# EAGLE schematic Glowdeck_beta_proto (EAGLE 6.3)

## Sheet 1 of 11: Main
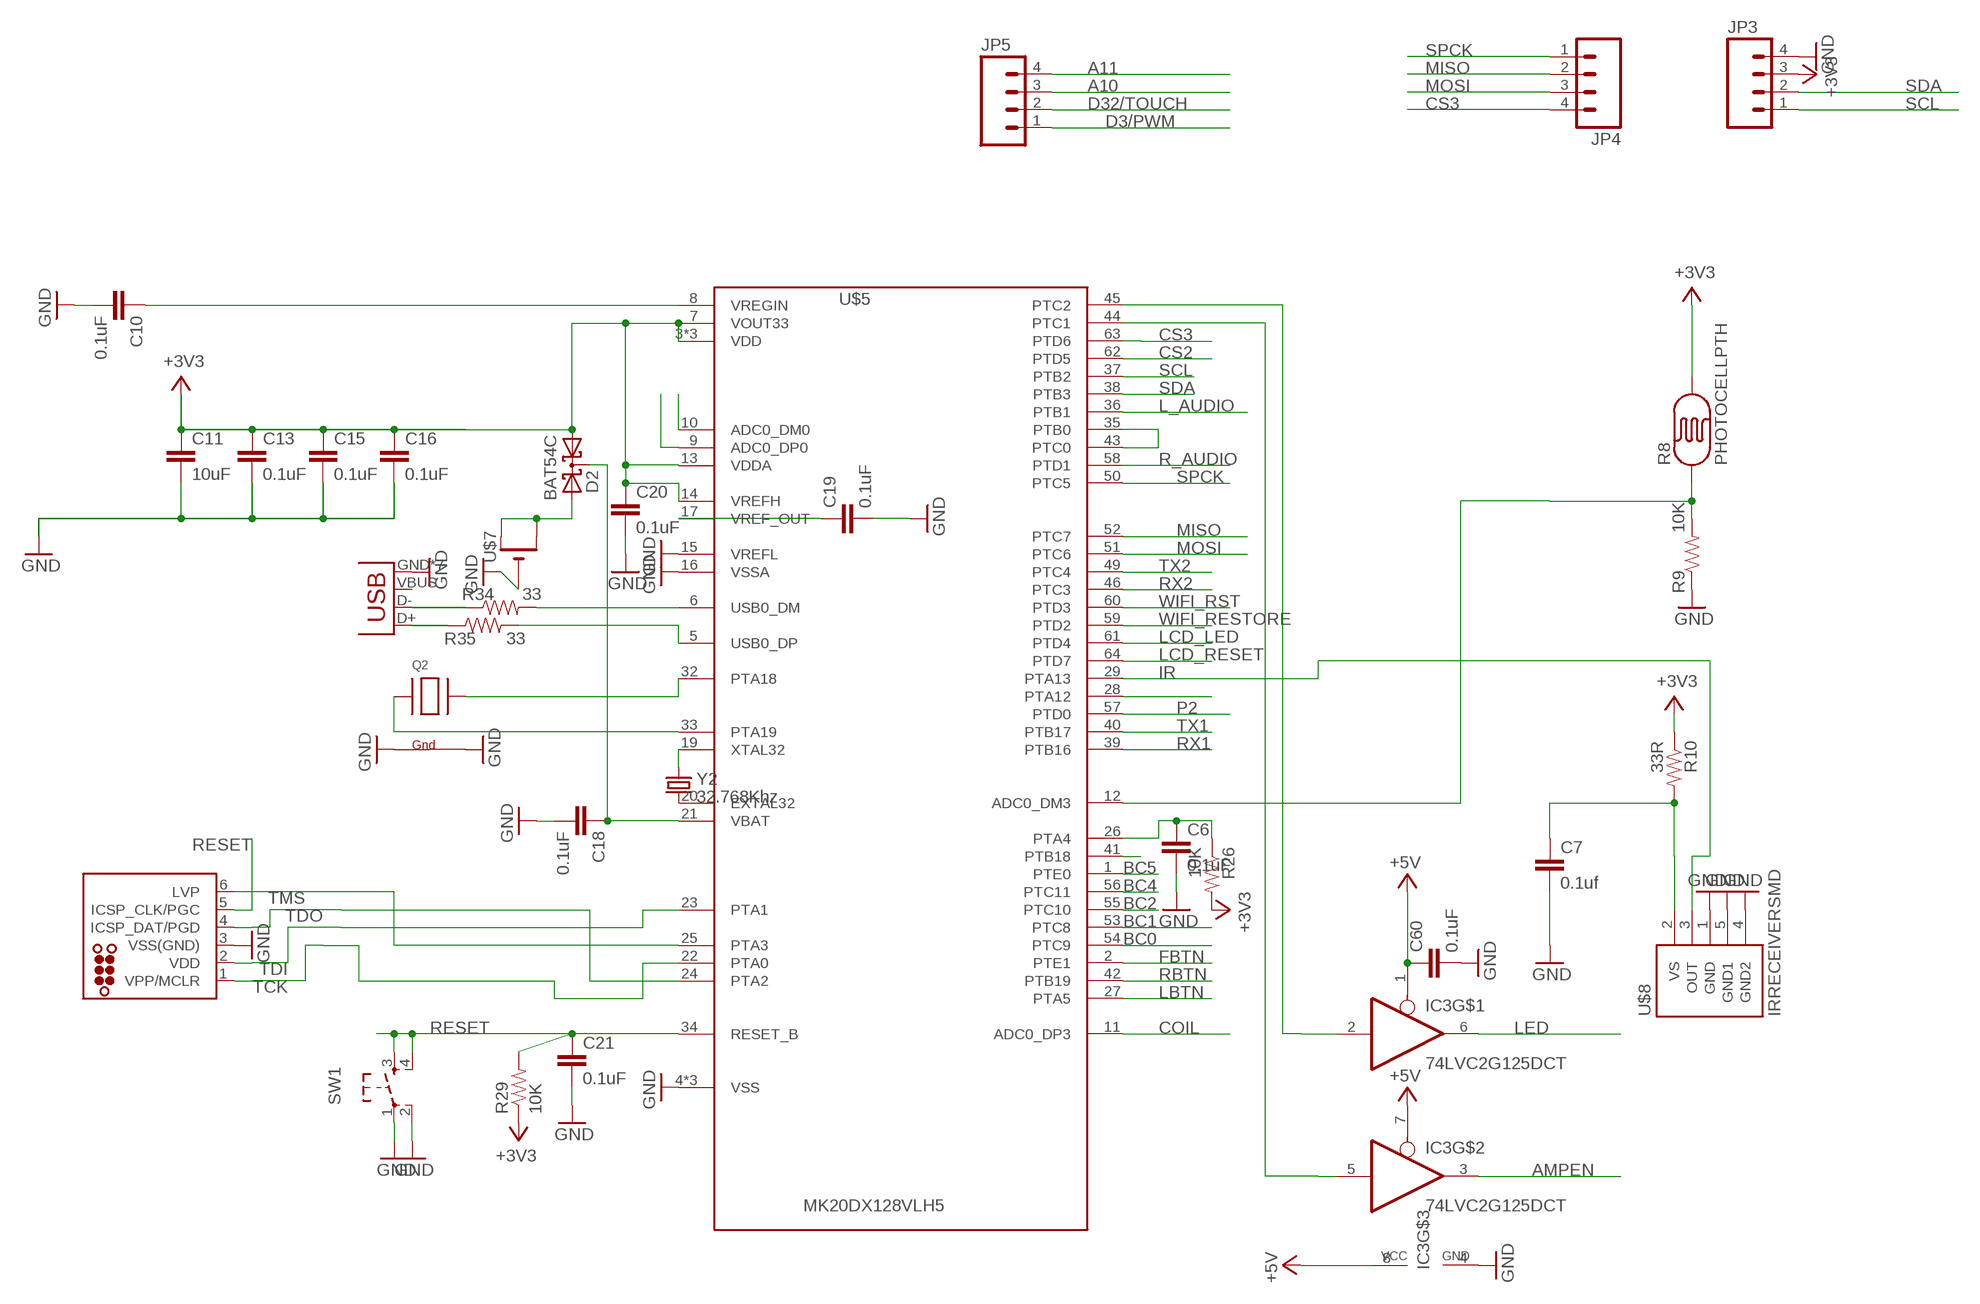
[diagram p0: schematic, sheet 1]

### Parts
C6  0.1uF  CAP0603-CAP  [0603-CAP]
C7  0.1uf  CAP0603-CAP  [0603-CAP]
C10  0.1uF  CAP0603-CAP  [0603-CAP]
C11  10uF  CAP0805  [0805]
C13  0.1uF  CAP0603-CAP  [0603-CAP]
C15  0.1uF  CAP0603-CAP  [0603-CAP]
C16  0.1uF  CAP0603-CAP  [0603-CAP]
C18  0.1uF  CAP0603-CAP  [0603-CAP]
C19  0.1uF  CAP0603-CAP  [0603-CAP]
C20  0.1uF  CAP0603-CAP  [0603-CAP]
C21  0.1uF  CAP0603-CAP  [0603-CAP]
C60  0.1uF  CAP0603-CAP  [0603-CAP]
D2  BAT54C  [SOT23]
IC3  74LVC2G125DCT  [SSOP08]
J2  TC2030-MCP-NL  [TC2030-MCP-NL]
JP3  M04LOCK  [1X04_LOCK]
JP4  M04LOCK  [1X04_LOCK]
JP5  M04LOCK  [1X04_LOCK]
Q2  XTAL-4-3225  [NX3225]
R8  PHOTOCELLPTH  [PHOTOCELL]
R9  10K  RESISTOR0603-RES  [0603-RES]
R10  33R  RESISTOR0603-RES  [0603-RES]
R26  10K  RESISTOR0603-RES  [0603-RES]
R29  10K  RESISTOR0603-RES  [0603-RES]
R34  33  RESISTOR0603-RES  [0603-RES]
R35  33  RESISTOR0603-RES  [0603-RES]
SW1  SW_TACT_4P  [SW_TACT_SMALL]
U$5  MK20DX128VLH5  [MK20DX128VLH5]
U$7  CR1220THM  [CR1220-THM]
U$8  IRRECEIVERSMD  [TSOP8523]
X3  USB-MICROB  [USB-MICROB]
Y2  32.768Khz  RESONATOR_EPSON_FC_145  [RESONATOR_EPSON_FC_145]

### Nets
+3V3 [+3V3]: C11.1 C13.1 C15.1 C16.1 C20.1 D2.1(A1) JP3.3 R8.2 R10.1 R26.2 R29.1 U$5.3(VDD) U$5.7(VOUT33) U$5.13(VDDA) U$5.14(VREFH) U$5.30(VDD) U$5.48(VDD) ; also sheet 2,3,4,5,9
+5V [5v]: C60.1 IC3.1(OE) IC3.7(OE) IC3.8(VCC) ; also sheet 3,4
A10: JP5.3 U$5.9(ADC0_DP0)
A11: JP5.4 U$5.10(ADC0_DM0)
AMPEN: IC3.3(O) ; also sheet 6
BC0: U$5.54(PTC9) ; also sheet 5
BC1: U$5.53(PTC8) ; also sheet 5
BC2: U$5.55(PTC10) ; also sheet 5
BC4: U$5.56(PTC11) ; also sheet 5
BC5: U$5.1(PTE0) ; also sheet 5
COIL: U$5.11(ADC0_DP3) ; also sheet 4
CS2: U$5.62(PTD5) ; also sheet 3
CS3: JP4.4 U$5.63(PTD6)
D3/PWM: JP5.1 U$5.28(PTA12)
D32/TOUCH: JP5.2 U$5.41(PTB18)
FBTN: U$5.2(PTE1) ; also sheet 10
GND [gnd]: C6.2 C7.2 C10.2 C11.2 C13.2 C15.2 C16.2 C18.2 C19.2 C20.2 C21.2 C60.2 IC3.4(GND) J2.3(VSS(GND)) JP3.4 Q2.2(G2) Q2.4(G1) R9.1 SW1.1 SW1.2 U$5.4(VSS) U$5.15(VREFL) U$5.16(VSSA) U$5.31(VSS) U$5.47(VSS) U$7.- U$8.1(GND) U$8.4(GND2) U$8.5(GND1) X3.GND X3.P1(GND) X3.P2(GND) X3.P3(GND) X3.P4(GND) X3.P5(GND) X3.P6(GND) ; also sheet 2,3,4,5,6,7,8,9,10
IR: U$5.29(PTA13) U$8.3(OUT)
L_AUDIO: U$5.36(PTB1) ; also sheet 9
LBTN: U$5.27(PTA5) ; also sheet 10
LCD_LED: U$5.61(PTD4) ; also sheet 3
LCD_RESET: U$5.64(PTD7) ; also sheet 3
LED: IC3.6(O) ; also sheet 8
MISO: JP4.2 U$5.52(PTC7) ; also sheet 3
MOSI: JP4.3 U$5.51(PTC6) ; also sheet 3
N$3: U$5.35(PTB0) U$5.43(PTC0)
N$4: C7.1 R10.2 U$8.2(VS)
N$31: Q2.3(X2) U$5.32(PTA18)
N$33: D2.2(A2) U$7.+1(+) U$7.+2(+1)
N$34: C6.1 R26.1 U$5.26(PTA4)
N$46: U$5.20(EXTAL32) Y2.P$2
N$48: C19.1 U$5.17(VREF_OUT)
N$49: C10.1 U$5.8(VREGIN)
N$50: C18.1 D2.3(CC) U$5.21(VBAT)
N$59: R34.2 U$5.6(USB0_DM)
N$60: R35.2 U$5.5(USB0_DP)
N$61: U$5.19(XTAL32) Y2.P$1
N$66: Q2.1(X1) U$5.33(PTA19)
N$67: R8.1 R9.2 U$5.12(ADC0_DM3)
N$76: IC3.5(I) U$5.44(PTC1)
N$79: IC3.2(I) U$5.45(PTC2)
N$95: R34.1 X3.D-
N$96: R35.1 X3.D+
P2: U$5.57(PTD0) ; also sheet 3
R_AUDIO: U$5.58(PTD1) ; also sheet 9
RBTN: U$5.42(PTB19) ; also sheet 10
RESET: C21.1 J2.5(ICSP_CLK/PGC) R29.2 SW1.3 SW1.4 U$5.34(RESET_B)
RX1: U$5.39(PTB16) ; also sheet 2
RX2: U$5.46(PTC3) ; also sheet 5
SCL: JP3.1 U$5.37(PTB2)
SDA: JP3.2 U$5.38(PTB3)
SPCK: JP4.1 U$5.50(PTC5) ; also sheet 3
TCK: J2.1(VPP/MCLR) U$5.22(PTA0)
TDI: J2.2(VDD) U$5.23(PTA1)
TDO: J2.4(ICSP_DAT/PGD) U$5.24(PTA2)
TMS: J2.6(LVP) U$5.25(PTA3)
TX1: U$5.40(PTB17) ; also sheet 2
TX2: U$5.49(PTC4) ; also sheet 5
WIFI_RESTORE: U$5.59(PTD2) ; also sheet 2
WIFI_RST: U$5.60(PTD3) ; also sheet 2
Unconnected: X3.VBUS

## Sheet 2 of 11: Wifi
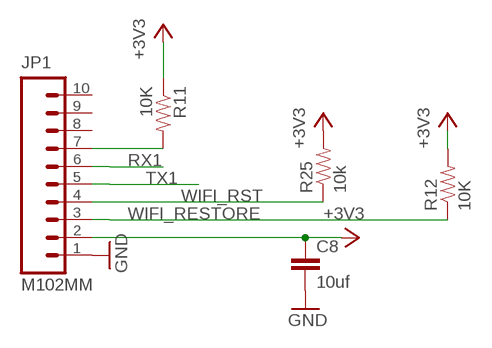
[diagram p1: schematic, sheet 2]

### Parts
C8  10uf  CAP0805  [0805]
JP1  M102MM  [1X10-2MM]
R11  10K  RESISTOR0603-RES  [0603-RES]
R12  10K  RESISTOR0603-RES  [0603-RES]
R25  10k  RESISTOR0603-RES  [0603-RES]

### Nets
+3V3 [+3V3]: C8.1 JP1.2 R11.1 R12.2 R25.2 ; also sheet 1,3,4,5,9
GND [gnd]: C8.2 JP1.1 ; also sheet 1,3,4,5,6,7,8,9,10
N$6: JP1.7 R11.2
RX1: JP1.6 ; also sheet 1
TX1: JP1.5 ; also sheet 1
WIFI_RESTORE: JP1.3 R12.1 ; also sheet 1
WIFI_RST: JP1.4 R25.1 ; also sheet 1
Unconnected: JP1.8 JP1.9 JP1.10

## Sheet 3 of 11: LCD/SD
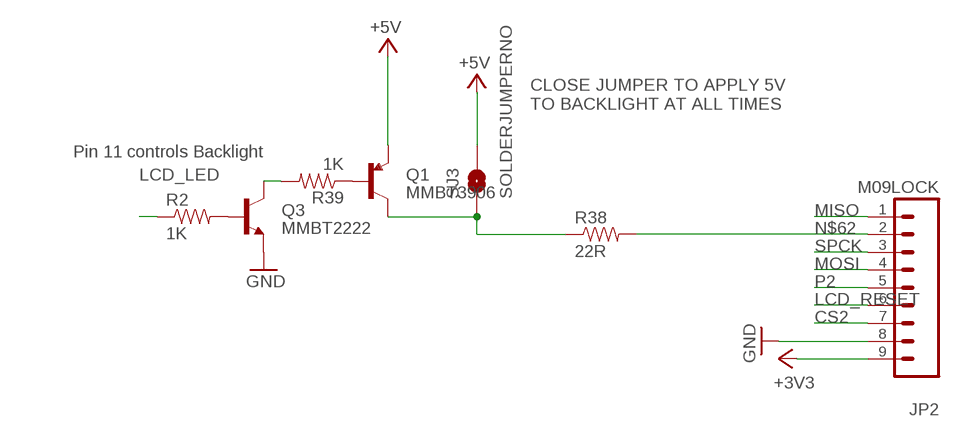
[diagram p2: schematic, sheet 3]

### Parts
JP2  M09LOCK  [1X09_LOCK]
Q1  MMBT3906  TRANSISTOR_PNPSMD  [SOT23-3]
Q3  MMBT2222  TRANSISTOR_NPNSOT23-3  [SOT23-3]
R2  1K  RESISTOR0603-RES  [0603-RES]
R38  22R  RESISTOR1206  [1206]
R39  1K  RESISTOR0603-RES  [0603-RES]
SJ3  SOLDERJUMPERNO  [SJ_2S-NO]

### Nets
+3V3 [+3V3]: JP2.9 ; also sheet 1,2,4,5,9
+5V [5v]: Q1.2(E) SJ3.2 ; also sheet 1,4
BACKLIGHT: Q1.3(C) R38.1 SJ3.1
CS2: JP2.7 ; also sheet 1
GND [gnd]: JP2.8 Q3.2(E) ; also sheet 1,2,4,5,6,7,8,9,10
LCD_LED: R2.1 ; also sheet 1
LCD_RESET: JP2.6 ; also sheet 1
MISO: JP2.1 ; also sheet 1
MOSI: JP2.4 ; also sheet 1
N$1: Q1.1(B) R39.1
N$62: JP2.2 R38.2
N$65: Q3.3(C) R39.2
N$68: Q3.1(B) R2.2
P2: JP2.5 ; also sheet 1
SPCK: JP2.3 ; also sheet 1

### Notes on the sheet
- CLOSE JUMPER TO APPLY 5V 
  TO BACKLIGHT AT ALL TIMES
- Pin 11 controls Backlight

## Sheet 4 of 11: VREG
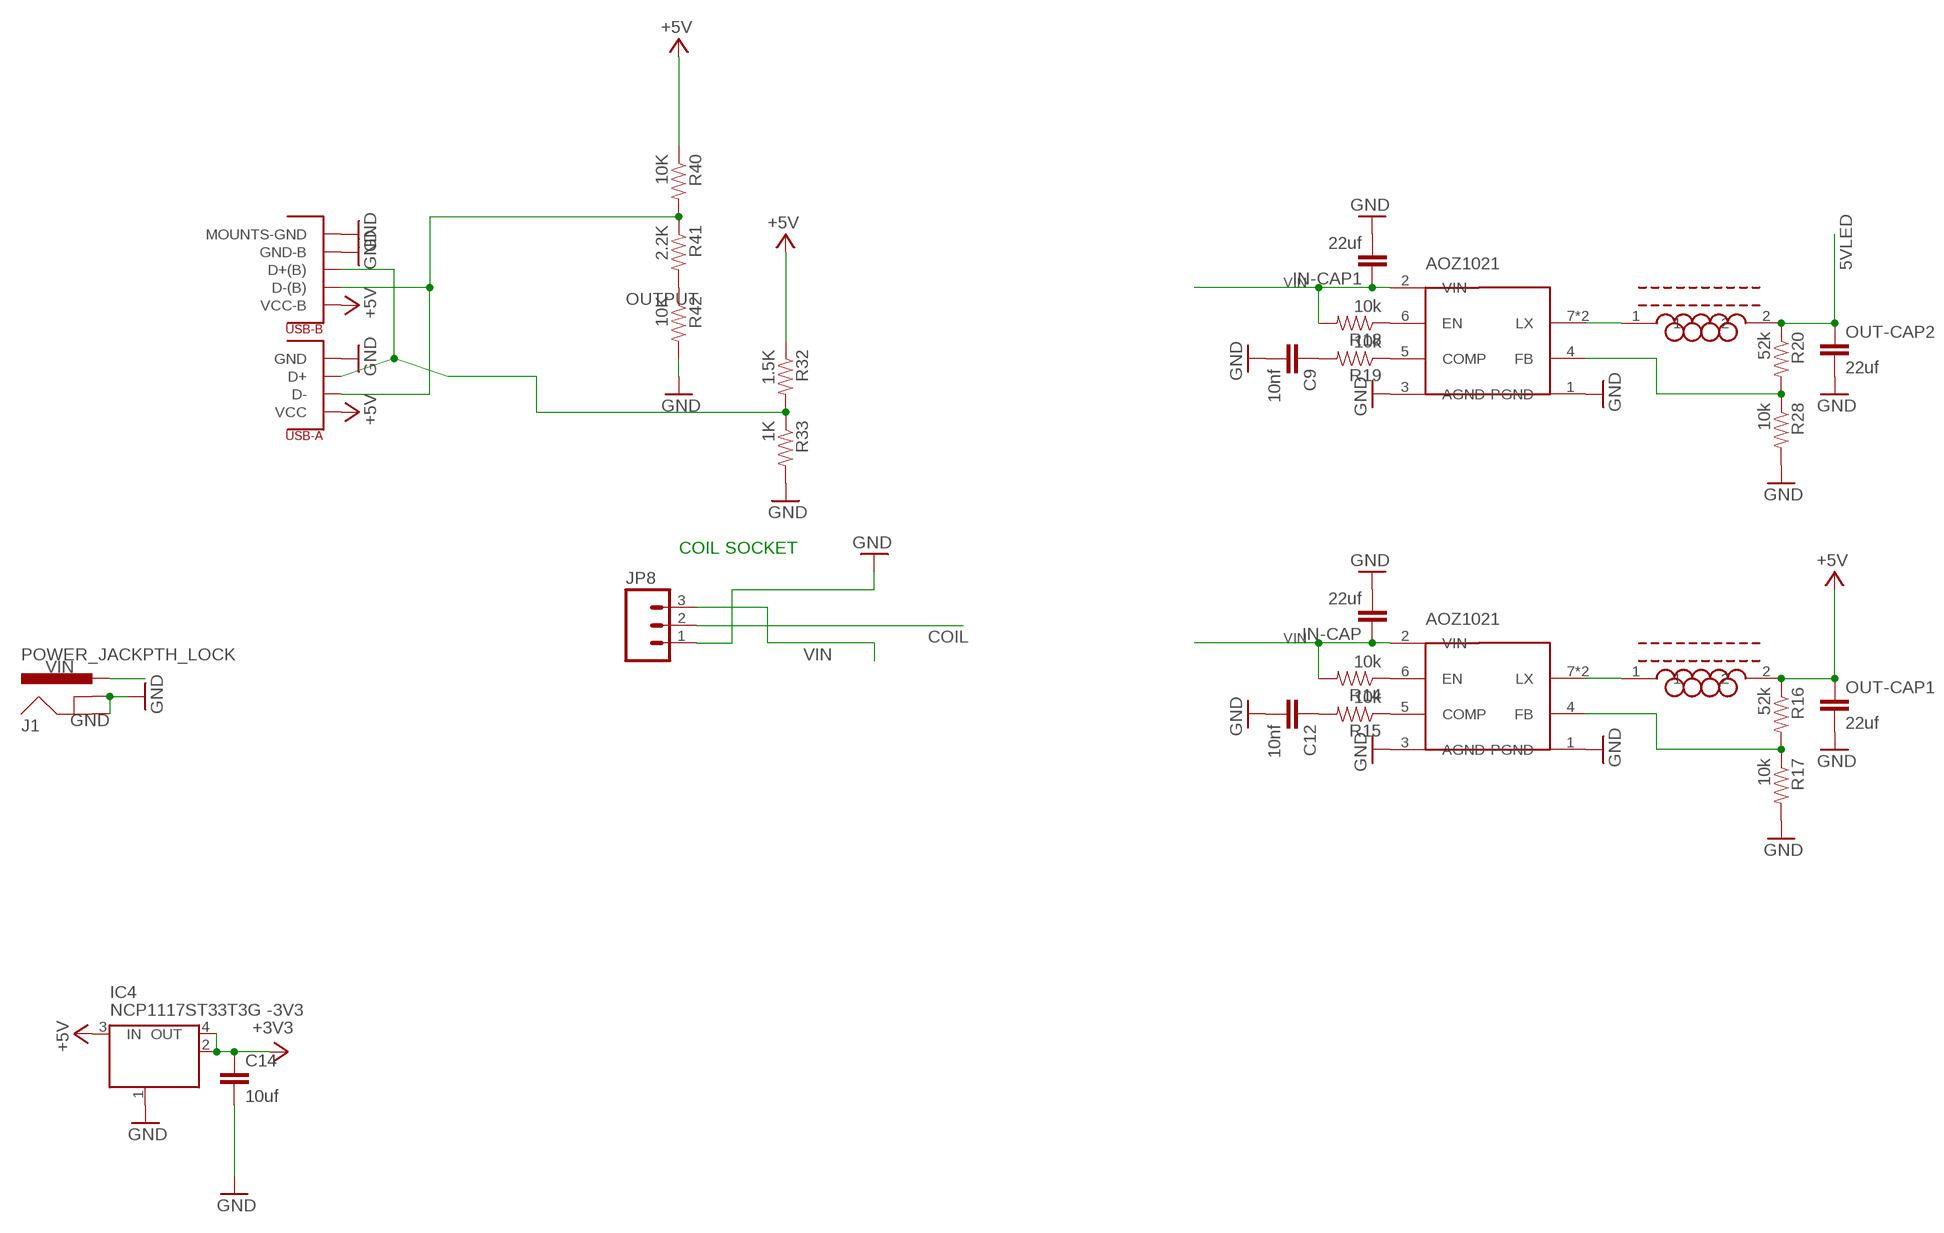
[diagram p3: schematic, sheet 4]

### Parts
AOZ1015AI  AOZ1021  [SO-08]
AOZ1015AI1  AOZ1021  [SO-08]
C9  10nf  CAP0603-CAP  [0603-CAP]
C12  10nf  CAP0603-CAP  [0603-CAP]
C14  10uf  CAP0805  [0805]
IC4  NCP1117ST33T3G -3V3  MC33269ST-3.3T3  [SOT223]
IN-CAP  22uf  CAP1210  [1210]
IN-CAP1  22uf  CAP1210  [1210]
J1  POWER_JACKPTH_LOCK  [POWER_JACK_PTH_LOCK]
JP8  M03JST-PTH  [JST-3-PTH]
OUT-CAP1  22uf  CAP1210  [1210]
OUT-CAP2  22uf  CAP1210  [1210]
R14  10k  RESISTOR0603-RES  [0603-RES]
R15  10k  RESISTOR0603-RES  [0603-RES]
R16  52k  RESISTOR0603-RES  [0603-RES]
R17  10k  RESISTOR0603-RES  [0603-RES]
R18  10k  RESISTOR0603-RES  [0603-RES]
R19  10k  RESISTOR0603-RES  [0603-RES]
R20  52k  RESISTOR0603-RES  [0603-RES]
R28  10k  RESISTOR0603-RES  [0603-RES]
R32  1.5K  RESISTOR0603-RES  [0603-RES]
R33  1K  RESISTOR0603-RES  [0603-RES]
R40  10K  RESISTOR0603-RES  [0603-RES]
R41  2.2K  RESISTOR0603-RES  [0603-RES]
R42  10K  RESISTOR0603-RES  [0603-RES]
U$1  SRP7030F  [SRP7030]
U$2  SRP7030F  [SRP7030]
U$6  DUAL-PORT-USB-REC  [DUAL-PORT-USB]

### Nets
5VLED [5v]: OUT-CAP2.1 R20.1 U$2.2 ; also sheet 8
+3V3 [+3V3]: C14.1 IC4.2(OUT) IC4.4(OUT) ; also sheet 1,2,3,5,9
+5V [5v]: IC4.3(IN) OUT-CAP1.1 R16.1 R32.1 R40.1 U$1.2 U$6.P$10(VCC-B) U$6.P$12(VCC) ; also sheet 1,3
COIL: JP8.2 ; also sheet 1
GND [gnd]: AOZ1015AI1.1(PGND) AOZ1015AI1.3(AGND) AOZ1015AI.1(PGND) AOZ1015AI.3(AGND) C9.2 C12.2 C14.2 IC4.1(GND/ADJ) IN-CAP1.2 IN-CAP.2 J1.GND J1.GNDBREAK JP8.1 OUT-CAP1.2 OUT-CAP2.2 R17.2 R28.2 R33.2 R42.2 U$6.GND(MOUNTS-GND) U$6.P$2(MOUNTS-GND) U$6.P$3(MOUNTS-GND) U$6.P$4(MOUNTS-GND) U$6.P$9(GND-B) U$6.P$11(GND) ; also sheet 1,2,3,5,6,7,8,9,10
LOUT [5VLED]: AOZ1015AI.7(LX) AOZ1015AI.8(LX) U$1.1
LOUT1 [5VLED]: AOZ1015AI1.7(LX) AOZ1015AI1.8(LX) U$2.1
N$9: AOZ1015AI1.6(EN) R18.1
N$10: AOZ1015AI.6(EN) R14.1
N$11: AOZ1015AI1.5(COMP) R19.1
N$12: C9.1 R19.2
N$13: AOZ1015AI.5(COMP) R15.1
N$14: C12.1 R15.2
N$15: AOZ1015AI.4(FB) R16.2 R17.1
N$18: AOZ1015AI1.4(FB) R20.2 R28.1
N$81: R32.2 R33.1 U$6.P$6(D+(B)) U$6.P$8(D+)
N$84 [gnd]: R41.2 R42.1
N$89: R40.2 R41.1 U$6.P$5(D-(B)) U$6.P$7(D-)
VIN: AOZ1015AI1.2(VIN) AOZ1015AI.2(VIN) IN-CAP1.1 IN-CAP.1 J1.PWR JP8.3 R14.2 R18.2 ; also sheet 6

### Notes on the sheet
- OUTPUT
- COIL SOCKET

## Sheet 5 of 11: BC127
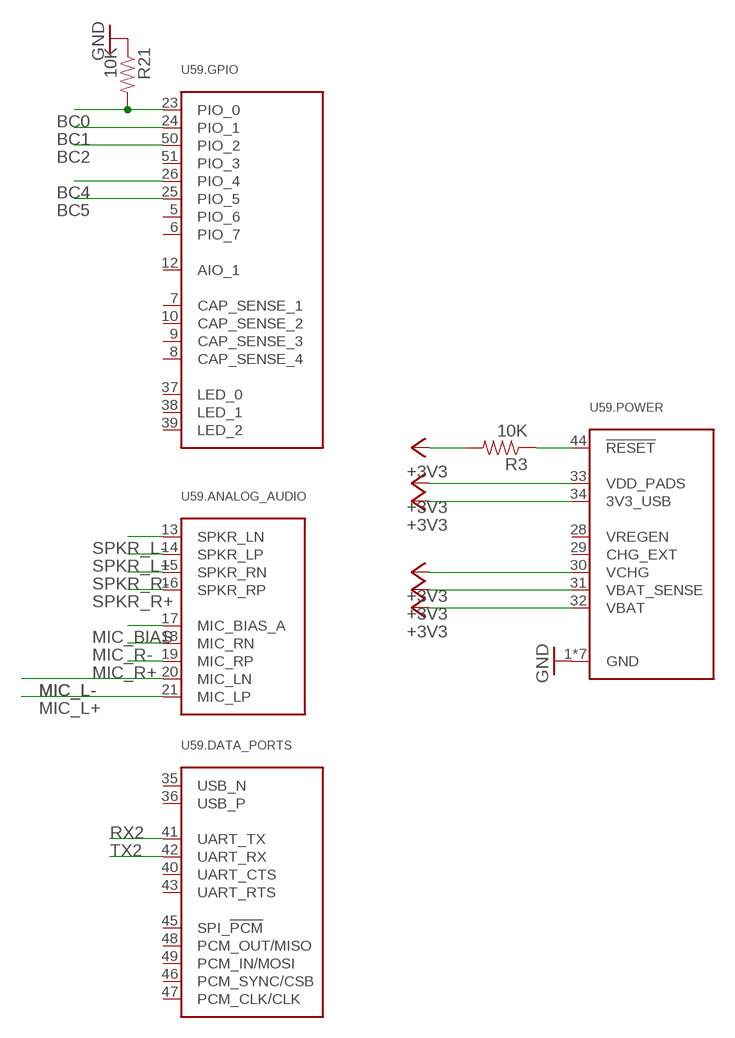
[diagram p4: schematic, sheet 5]

### Parts
R3  10K  RESISTOR0603-RES  [0603-RES]
R21  10K  RESISTOR0603-RES  [0603-RES]
U59  BC127EXTRA_PASTE  [BC127_XTRA_PASTE]

### Nets
+3V3 [+3V3]: R3.2 U59.30(.POWER:VCHG) U59.31(.POWER:VBAT_SENSE) U59.32(.POWER:VBAT) U59.33(.POWER:VDD_PADS) U59.34(.POWER:3V3_USB) ; also sheet 1,2,3,4,9
BC0: R21.2 U59.23(.GPIO:PIO_0) ; also sheet 1
BC1: U59.24(.GPIO:PIO_1) ; also sheet 1
BC2: U59.50(.GPIO:PIO_2) ; also sheet 1
BC4: U59.26(.GPIO:PIO_4) ; also sheet 1
BC5: U59.25(.GPIO:PIO_5) ; also sheet 1
GND [gnd]: R21.1 U59.1(.POWER:GND) U59.2(.POWER:GND) U59.3(.POWER:GND) U59.4(.POWER:GND) U59.11(.POWER:GND) U59.22(.POWER:GND) U59.27(.POWER:GND) ; also sheet 1,2,3,4,6,7,8,9,10
MIC_BIAS: U59.17(.ANALOG_AUDIO:MIC_BIAS_A) ; also sheet 7
MIC_L+: U59.21(.ANALOG_AUDIO:MIC_LP) ; also sheet 7
MIC_L-: U59.20(.ANALOG_AUDIO:MIC_LN) ; also sheet 7
MIC_R+: U59.19(.ANALOG_AUDIO:MIC_RP)
MIC_R-: U59.18(.ANALOG_AUDIO:MIC_RN)
N$91: R3.1 U59.44(.POWER:!RESET)
RX2: U59.41(.DATA_PORTS:UART_TX) ; also sheet 1
SPKR_L+: U59.14(.ANALOG_AUDIO:SPKR_LP) ; also sheet 6,9
SPKR_L-: U59.13(.ANALOG_AUDIO:SPKR_LN) ; also sheet 6,9
SPKR_R+: U59.16(.ANALOG_AUDIO:SPKR_RP) ; also sheet 6,9
SPKR_R-: U59.15(.ANALOG_AUDIO:SPKR_RN) ; also sheet 6,9
TX2: U59.42(.DATA_PORTS:UART_RX) ; also sheet 1
Unconnected: U59.5(.GPIO:PIO_6) U59.6(.GPIO:PIO_7) U59.7(.GPIO:CAP_SENSE_1) U59.8(.GPIO:CAP_SENSE_4) U59.9(.GPIO:CAP_SENSE_3) U59.10(.GPIO:CAP_SENSE_2) U59.12(.GPIO:AIO_1) U59.28(.POWER:VREGEN) U59.29(.POWER:CHG_EXT) U59.35(.DATA_PORTS:USB_N) U59.36(.DATA_PORTS:USB_P) U59.37(.GPIO:LED_0) U59.38(.GPIO:LED_1) U59.39(.GPIO:LED_2) U59.40(.DATA_PORTS:UART_CTS) U59.43(.DATA_PORTS:UART_RTS) U59.45(.DATA_PORTS:SPI_!PCM) U59.46(.DATA_PORTS:PCM_SYNC/CSB) U59.47(.DATA_PORTS:PCM_CLK/CLK) U59.48(.DATA_PORTS:PCM_OUT/MISO) U59.49(.DATA_PORTS:PCM_IN/MOSI) U59.51(.GPIO:PIO_3)

## Sheet 6 of 11: AMP
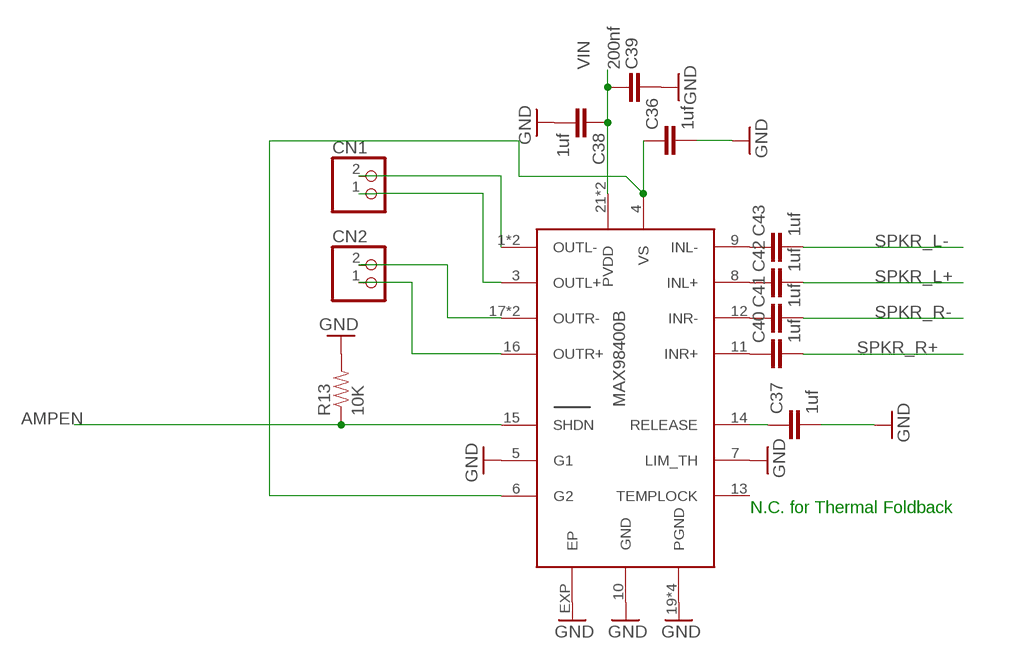
[diagram p5: schematic, sheet 6]

### Parts
C36  1uf  CAP0805  [0805]
C37  1uf  CAP0805  [0805]
C38  1uf  CAP0805  [0805]
C39  200nf  CAP0603-CAP  [0603-CAP]
C40  1uf  CAP0805  [0805]
C41  1uf  CAP0805  [0805]
C42  1uf  CAP0805  [0805]
C43  1uf  CAP0805  [0805]
CN1  JST_2PIN-THM  [JST-PH-2-THM]
CN2  JST_2PIN-THM  [JST-PH-2-THM]
R13  10K  RESISTOR0603-RES  [0603-RES]
U$3  MAX98400B  [TQFN24-EP]

### Nets
AMPEN: R13.1 U$3.15(SHDN) ; also sheet 1
GND [gnd]: C36.2 C37.2 C38.2 C39.1 R13.2 U$3.5(G1) U$3.7(LIM_TH) U$3.10(GND) U$3.19(PGND) U$3.20(PGND) U$3.23(PGND) U$3.24(PGND) U$3.EXP(EP) ; also sheet 1,2,3,4,5,7,8,9,10
N$20: C40.1 U$3.11(INR+)
N$21: C41.1 U$3.12(INR-)
N$22: C42.1 U$3.8(INL+)
N$23: C43.1 U$3.9(INL-)
N$24 [SPK]: CN2.1 U$3.16(OUTR+)
N$25 [SPK]: CN2.2 U$3.17(OUTR-) U$3.18(OUTR-)
N$26 [SPK]: CN1.1 U$3.3(OUTL+)
N$27 [SPK]: CN1.2 U$3.1(OUTL-) U$3.2(OUTL-)
N$87: C37.1 U$3.14(RELEASE)
N$90: C36.1 U$3.4(VS) U$3.6(G2)
SPKR_L+: C42.2 ; also sheet 5,9
SPKR_L-: C43.2 ; also sheet 5,9
SPKR_R+: C40.2 ; also sheet 5,9
SPKR_R-: C41.2 ; also sheet 5,9
VIN: C38.1 C39.2 U$3.21(PVDD) U$3.22(PVDD) ; also sheet 4
Unconnected: U$3.13(TEMPLOCK)

### Notes on the sheet
- N.C. for Thermal Foldback

## Sheet 7 of 11: MIC
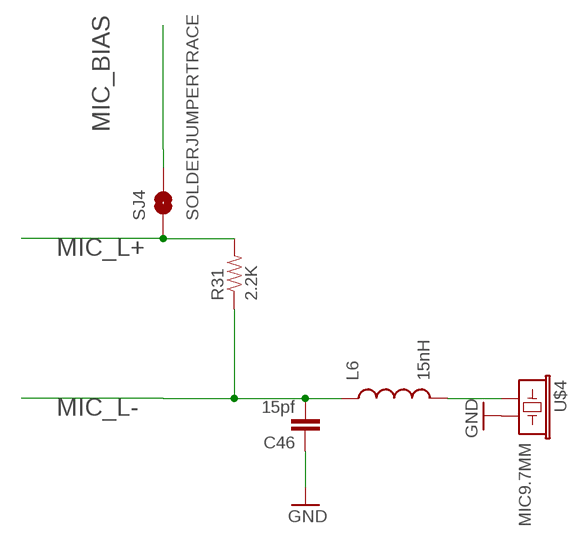
[diagram p6: schematic, sheet 7]

### Parts
C46  15pf  CAP0805  [0805]
L6  15nH  INDUCTOR0603  [0603]
R31  2.2K  RESISTOR0603-RES  [0603-RES]
SJ4  SOLDERJUMPERTRACE  [SJ_2S-TRACE]
U$4  MIC9.7MM  [MIC-9.7MM]

### Nets
GND [gnd]: C46.1 U$4.2 ; also sheet 1,2,3,4,5,6,8,9,10
MIC_BIAS: SJ4.2 ; also sheet 5
MIC_L+: R31.2 SJ4.1 ; also sheet 5
MIC_L-: C46.2 L6.1 R31.1 ; also sheet 5
N$28: L6.2 U$4.1

## Sheet 8 of 11: LEDs
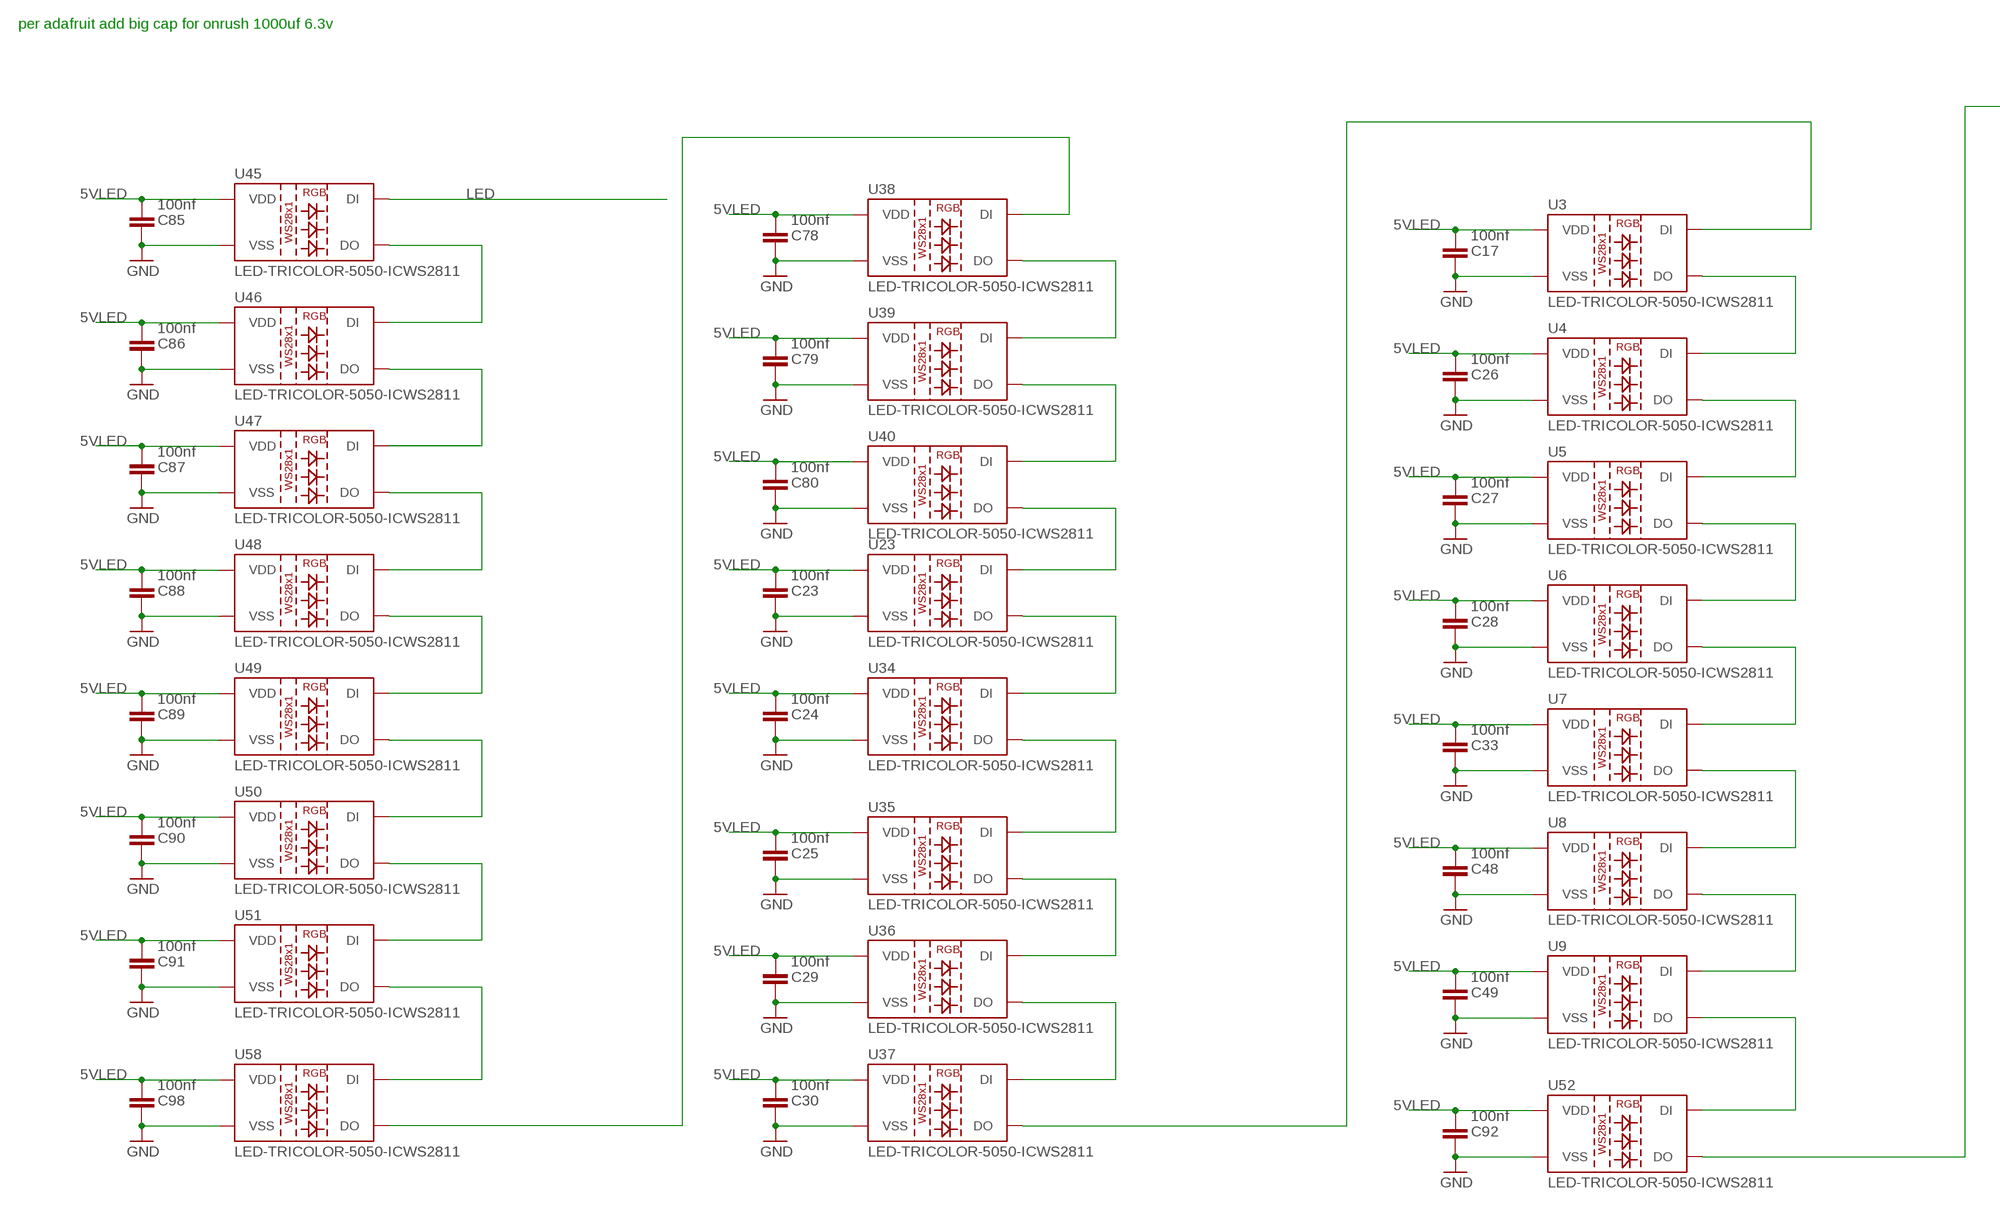
[diagram p7: schematic, sheet 8, part 1 of 2]
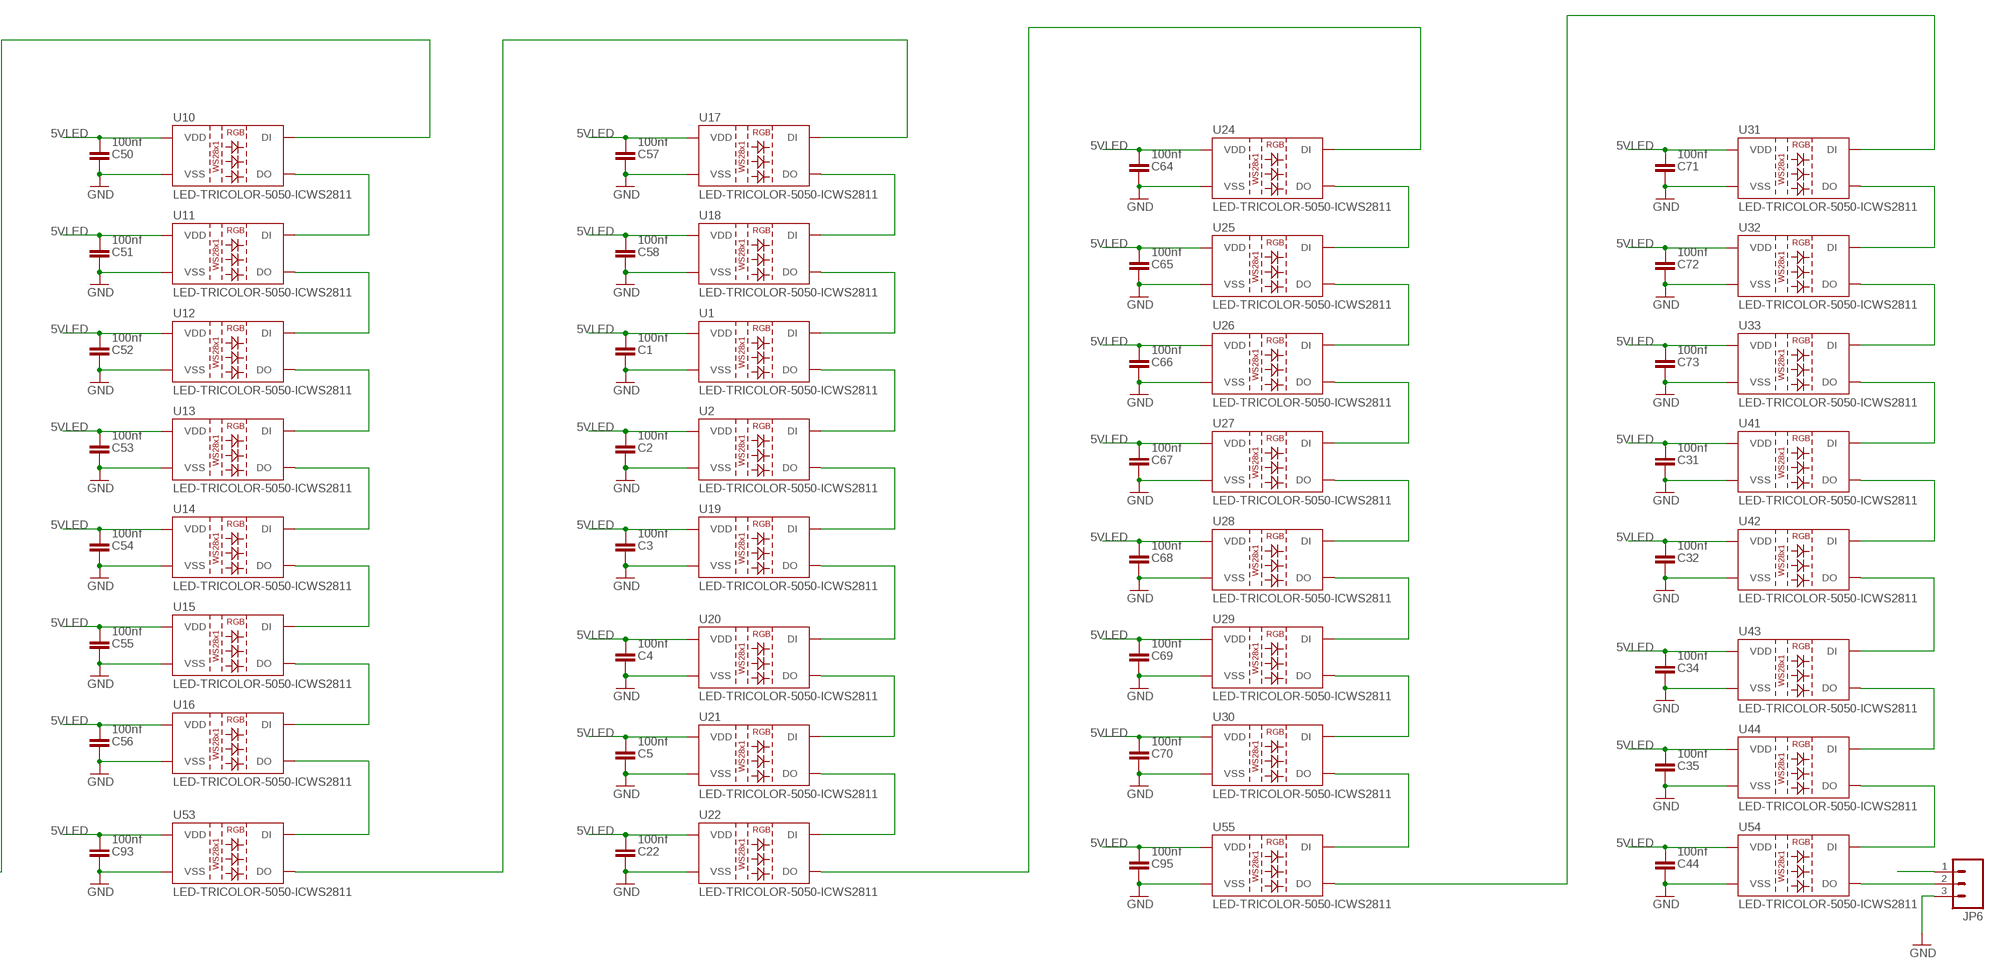
[diagram p8: schematic, sheet 8, part 2 of 2]

### Parts
C1  100nf  CAP0603-CAP  [0603-CAP]
C2  100nf  CAP0603-CAP  [0603-CAP]
C3  100nf  CAP0603-CAP  [0603-CAP]
C4  100nf  CAP0603-CAP  [0603-CAP]
C5  100nf  CAP0603-CAP  [0603-CAP]
C17  100nf  CAP0603-CAP  [0603-CAP]
C22  100nf  CAP0603-CAP  [0603-CAP]
C23  100nf  CAP0603-CAP  [0603-CAP]
C24  100nf  CAP0603-CAP  [0603-CAP]
C25  100nf  CAP0603-CAP  [0603-CAP]
C26  100nf  CAP0603-CAP  [0603-CAP]
C27  100nf  CAP0603-CAP  [0603-CAP]
C28  100nf  CAP0603-CAP  [0603-CAP]
C29  100nf  CAP0603-CAP  [0603-CAP]
C30  100nf  CAP0603-CAP  [0603-CAP]
C31  100nf  CAP0603-CAP  [0603-CAP]
C32  100nf  CAP0603-CAP  [0603-CAP]
C33  100nf  CAP0603-CAP  [0603-CAP]
C34  100nf  CAP0603-CAP  [0603-CAP]
C35  100nf  CAP0603-CAP  [0603-CAP]
C44  100nf  CAP0603-CAP  [0603-CAP]
C48  100nf  CAP0603-CAP  [0603-CAP]
C49  100nf  CAP0603-CAP  [0603-CAP]
C50  100nf  CAP0603-CAP  [0603-CAP]
C51  100nf  CAP0603-CAP  [0603-CAP]
C52  100nf  CAP0603-CAP  [0603-CAP]
C53  100nf  CAP0603-CAP  [0603-CAP]
C54  100nf  CAP0603-CAP  [0603-CAP]
C55  100nf  CAP0603-CAP  [0603-CAP]
C56  100nf  CAP0603-CAP  [0603-CAP]
C57  100nf  CAP0603-CAP  [0603-CAP]
C58  100nf  CAP0603-CAP  [0603-CAP]
C64  100nf  CAP0603-CAP  [0603-CAP]
C65  100nf  CAP0603-CAP  [0603-CAP]
C66  100nf  CAP0603-CAP  [0603-CAP]
C67  100nf  CAP0603-CAP  [0603-CAP]
C68  100nf  CAP0603-CAP  [0603-CAP]
C69  100nf  CAP0603-CAP  [0603-CAP]
C70  100nf  CAP0603-CAP  [0603-CAP]
C71  100nf  CAP0603-CAP  [0603-CAP]
C72  100nf  CAP0603-CAP  [0603-CAP]
C73  100nf  CAP0603-CAP  [0603-CAP]
C78  100nf  CAP0603-CAP  [0603-CAP]
C79  100nf  CAP0603-CAP  [0603-CAP]
C80  100nf  CAP0603-CAP  [0603-CAP]
C85  100nf  CAP0603-CAP  [0603-CAP]
C86  100nf  CAP0603-CAP  [0603-CAP]
C87  100nf  CAP0603-CAP  [0603-CAP]
C88  100nf  CAP0603-CAP  [0603-CAP]
C89  100nf  CAP0603-CAP  [0603-CAP]
C90  100nf  CAP0603-CAP  [0603-CAP]
C91  100nf  CAP0603-CAP  [0603-CAP]
C92  100nf  CAP0603-CAP  [0603-CAP]
C93  100nf  CAP0603-CAP  [0603-CAP]
C95  100nf  CAP0603-CAP  [0603-CAP]
C98  100nf  CAP0603-CAP  [0603-CAP]
JP6  M03LOCK  [1X03_LOCK]
U1  LED-TRICOLOR-5050-ICWS2811  [LED-TRICOLOR-5050-IC]
U2  LED-TRICOLOR-5050-ICWS2811  [LED-TRICOLOR-5050-IC]
U3  LED-TRICOLOR-5050-ICWS2811  [LED-TRICOLOR-5050-IC]
U4  LED-TRICOLOR-5050-ICWS2811  [LED-TRICOLOR-5050-IC]
U5  LED-TRICOLOR-5050-ICWS2811  [LED-TRICOLOR-5050-IC]
U6  LED-TRICOLOR-5050-ICWS2811  [LED-TRICOLOR-5050-IC]
U7  LED-TRICOLOR-5050-ICWS2811  [LED-TRICOLOR-5050-IC]
U8  LED-TRICOLOR-5050-ICWS2811  [LED-TRICOLOR-5050-IC]
U9  LED-TRICOLOR-5050-ICWS2811  [LED-TRICOLOR-5050-IC]
U10  LED-TRICOLOR-5050-ICWS2811  [LED-TRICOLOR-5050-IC]
U11  LED-TRICOLOR-5050-ICWS2811  [LED-TRICOLOR-5050-IC]
U12  LED-TRICOLOR-5050-ICWS2811  [LED-TRICOLOR-5050-IC]
U13  LED-TRICOLOR-5050-ICWS2811  [LED-TRICOLOR-5050-IC]
U14  LED-TRICOLOR-5050-ICWS2811  [LED-TRICOLOR-5050-IC]
U15  LED-TRICOLOR-5050-ICWS2811  [LED-TRICOLOR-5050-IC]
U16  LED-TRICOLOR-5050-ICWS2811  [LED-TRICOLOR-5050-IC]
U17  LED-TRICOLOR-5050-ICWS2811  [LED-TRICOLOR-5050-IC]
U18  LED-TRICOLOR-5050-ICWS2811  [LED-TRICOLOR-5050-IC]
U19  LED-TRICOLOR-5050-ICWS2811  [LED-TRICOLOR-5050-IC]
U20  LED-TRICOLOR-5050-ICWS2811  [LED-TRICOLOR-5050-IC]
U21  LED-TRICOLOR-5050-ICWS2811  [LED-TRICOLOR-5050-IC]
U22  LED-TRICOLOR-5050-ICWS2811  [LED-TRICOLOR-5050-IC]
U23  LED-TRICOLOR-5050-ICWS2811  [LED-TRICOLOR-5050-IC]
U24  LED-TRICOLOR-5050-ICWS2811  [LED-TRICOLOR-5050-IC]
U25  LED-TRICOLOR-5050-ICWS2811  [LED-TRICOLOR-5050-IC]
U26  LED-TRICOLOR-5050-ICWS2811  [LED-TRICOLOR-5050-IC]
U27  LED-TRICOLOR-5050-ICWS2811  [LED-TRICOLOR-5050-IC]
U28  LED-TRICOLOR-5050-ICWS2811  [LED-TRICOLOR-5050-IC]
U29  LED-TRICOLOR-5050-ICWS2811  [LED-TRICOLOR-5050-IC]
U30  LED-TRICOLOR-5050-ICWS2811  [LED-TRICOLOR-5050-IC]
U31  LED-TRICOLOR-5050-ICWS2811  [LED-TRICOLOR-5050-IC]
U32  LED-TRICOLOR-5050-ICWS2811  [LED-TRICOLOR-5050-IC]
U33  LED-TRICOLOR-5050-ICWS2811  [LED-TRICOLOR-5050-IC]
U34  LED-TRICOLOR-5050-ICWS2811  [LED-TRICOLOR-5050-IC]
U35  LED-TRICOLOR-5050-ICWS2811  [LED-TRICOLOR-5050-IC]
U36  LED-TRICOLOR-5050-ICWS2811  [LED-TRICOLOR-5050-IC]
U37  LED-TRICOLOR-5050-ICWS2811  [LED-TRICOLOR-5050-IC]
U38  LED-TRICOLOR-5050-ICWS2811  [LED-TRICOLOR-5050-IC]
U39  LED-TRICOLOR-5050-ICWS2811  [LED-TRICOLOR-5050-IC]
U40  LED-TRICOLOR-5050-ICWS2811  [LED-TRICOLOR-5050-IC]
U41  LED-TRICOLOR-5050-ICWS2811  [LED-TRICOLOR-5050-IC]
U42  LED-TRICOLOR-5050-ICWS2811  [LED-TRICOLOR-5050-IC]
U43  LED-TRICOLOR-5050-ICWS2811  [LED-TRICOLOR-5050-IC]
U44  LED-TRICOLOR-5050-ICWS2811  [LED-TRICOLOR-5050-IC]
U45  LED-TRICOLOR-5050-ICWS2811  [LED-TRICOLOR-5050-IC]
U46  LED-TRICOLOR-5050-ICWS2811  [LED-TRICOLOR-5050-IC]
U47  LED-TRICOLOR-5050-ICWS2811  [LED-TRICOLOR-5050-IC]
U48  LED-TRICOLOR-5050-ICWS2811  [LED-TRICOLOR-5050-IC]
U49  LED-TRICOLOR-5050-ICWS2811  [LED-TRICOLOR-5050-IC]
U50  LED-TRICOLOR-5050-ICWS2811  [LED-TRICOLOR-5050-IC]
U51  LED-TRICOLOR-5050-ICWS2811  [LED-TRICOLOR-5050-IC]
U52  LED-TRICOLOR-5050-ICWS2811  [LED-TRICOLOR-5050-IC]
U53  LED-TRICOLOR-5050-ICWS2811  [LED-TRICOLOR-5050-IC]
U54  LED-TRICOLOR-5050-ICWS2811  [LED-TRICOLOR-5050-IC]
U55  LED-TRICOLOR-5050-ICWS2811  [LED-TRICOLOR-5050-IC]
U58  LED-TRICOLOR-5050-ICWS2811  [LED-TRICOLOR-5050-IC]

### Nets
5VLED [5v]: C1.2 C2.2 C3.2 C4.2 C5.2 C17.2 C22.2 C23.2 C24.2 C25.2 C26.2 C27.2 C28.2 C29.2 C30.2 C31.2 C32.2 C33.2 C34.2 C35.2 C44.2 C48.2 C49.2 C50.2 C51.2 C52.2 C53.2 C54.2 C55.2 C56.2 C57.2 C58.2 C64.2 C65.2 C66.2 C67.2 C68.2 C69.2 C70.2 C71.2 C72.2 C73.2 C78.2 C79.2 C80.2 C85.2 C86.2 C87.2 C88.2 C89.2 C90.2 C91.2 C92.2 C93.2 C95.2 C98.2 JP6.1 U1.1(VDD) U2.1(VDD) U3.1(VDD) U4.1(VDD) U5.1(VDD) U6.1(VDD) U7.1(VDD) U8.1(VDD) U9.1(VDD) U10.1(VDD) U11.1(VDD) U12.1(VDD) U13.1(VDD) U14.1(VDD) U15.1(VDD) U16.1(VDD) U17.1(VDD) U18.1(VDD) U19.1(VDD) U20.1(VDD) U21.1(VDD) U22.1(VDD) U23.1(VDD) U24.1(VDD) U25.1(VDD) U26.1(VDD) U27.1(VDD) U28.1(VDD) U29.1(VDD) U30.1(VDD) U31.1(VDD) U32.1(VDD) U33.1(VDD) U34.1(VDD) U35.1(VDD) U36.1(VDD) U37.1(VDD) U38.1(VDD) U39.1(VDD) U40.1(VDD) U41.1(VDD) U42.1(VDD) U43.1(VDD) U44.1(VDD) U45.1(VDD) U46.1(VDD) U47.1(VDD) U48.1(VDD) U49.1(VDD) U50.1(VDD) U51.1(VDD) U52.1(VDD) U53.1(VDD) U54.1(VDD) U55.1(VDD) U58.1(VDD) ; also sheet 4
GND [gnd]: C1.1 C2.1 C3.1 C4.1 C5.1 C17.1 C22.1 C23.1 C24.1 C25.1 C26.1 C27.1 C28.1 C29.1 C30.1 C31.1 C32.1 C33.1 C34.1 C35.1 C44.1 C48.1 C49.1 C50.1 C51.1 C52.1 C53.1 C54.1 C55.1 C56.1 C57.1 C58.1 C64.1 C65.1 C66.1 C67.1 C68.1 C69.1 C70.1 C71.1 C72.1 C73.1 C78.1 C79.1 C80.1 C85.1 C86.1 C87.1 C88.1 C89.1 C90.1 C91.1 C92.1 C93.1 C95.1 C98.1 JP6.3 U1.3(VSS) U2.3(VSS) U3.3(VSS) U4.3(VSS) U5.3(VSS) U6.3(VSS) U7.3(VSS) U8.3(VSS) U9.3(VSS) U10.3(VSS) U11.3(VSS) U12.3(VSS) U13.3(VSS) U14.3(VSS) U15.3(VSS) U16.3(VSS) U17.3(VSS) U18.3(VSS) U19.3(VSS) U20.3(VSS) U21.3(VSS) U22.3(VSS) U23.3(VSS) U24.3(VSS) U25.3(VSS) U26.3(VSS) U27.3(VSS) U28.3(VSS) U29.3(VSS) U30.3(VSS) U31.3(VSS) U32.3(VSS) U33.3(VSS) U34.3(VSS) U35.3(VSS) U36.3(VSS) U37.3(VSS) U38.3(VSS) U39.3(VSS) U40.3(VSS) U41.3(VSS) U42.3(VSS) U43.3(VSS) U44.3(VSS) U45.3(VSS) U46.3(VSS) U47.3(VSS) U48.3(VSS) U49.3(VSS) U50.3(VSS) U51.3(VSS) U52.3(VSS) U53.3(VSS) U54.3(VSS) U55.3(VSS) U58.3(VSS) ; also sheet 1,2,3,4,5,6,7,9,10
LED: U45.4(DI) ; also sheet 1
N$2: U23.4(DI) U40.2(DO)
N$5: U42.2(DO) U43.4(DI)
N$16: U1.2(DO) U2.4(DI)
N$17: U1.4(DI) U18.2(DO)
N$19: U33.2(DO) U41.4(DI)
N$29: U3.2(DO) U4.4(DI)
N$30: U4.2(DO) U5.4(DI)
N$35: U5.2(DO) U6.4(DI)
N$36: U6.2(DO) U7.4(DI)
N$37: U7.2(DO) U8.4(DI)
N$38: U8.2(DO) U9.4(DI)
N$39: U10.2(DO) U11.4(DI)
N$40: U11.2(DO) U12.4(DI)
N$41: U12.2(DO) U13.4(DI)
N$42: U13.2(DO) U14.4(DI)
N$43: U14.2(DO) U15.4(DI)
N$44: U15.2(DO) U16.4(DI)
N$45: U17.2(DO) U18.4(DI)
N$47: U2.2(DO) U19.4(DI)
N$51: U24.2(DO) U25.4(DI)
N$52: U25.2(DO) U26.4(DI)
N$53: U26.2(DO) U27.4(DI)
N$54: U27.2(DO) U28.4(DI)
N$55: U28.2(DO) U29.4(DI)
N$56: U29.2(DO) U30.4(DI)
N$57: U31.2(DO) U32.4(DI)
N$58: U32.2(DO) U33.4(DI)
N$63: U38.2(DO) U39.4(DI)
N$64: U39.2(DO) U40.4(DI)
N$69: U45.2(DO) U46.4(DI)
N$70: U46.2(DO) U47.4(DI)
N$71: U47.2(DO) U48.4(DI)
N$72: U48.2(DO) U49.4(DI)
N$73: U49.2(DO) U50.4(DI)
N$74: U50.2(DO) U51.4(DI)
N$75: U38.4(DI) U58.2(DO)
N$77: U10.4(DI) U52.2(DO)
N$78: U17.4(DI) U53.2(DO)
N$80: U31.4(DI) U55.2(DO)
N$82: U9.2(DO) U52.4(DI)
N$83: U16.2(DO) U53.4(DI)
N$85: U30.2(DO) U55.4(DI)
N$86: U19.2(DO) U20.4(DI)
N$88: U51.2(DO) U58.4(DI)
N$93: U20.2(DO) U21.4(DI)
N$94: U21.2(DO) U22.4(DI)
N$98: U22.2(DO) U24.4(DI)
N$105: U23.2(DO) U34.4(DI)
N$107: U34.2(DO) U35.4(DI)
N$109: U35.2(DO) U36.4(DI)
N$111: U36.2(DO) U37.4(DI)
N$114: U3.4(DI) U37.2(DO)
N$117: U41.2(DO) U42.4(DI)
N$122: U43.2(DO) U44.4(DI)
N$123: U44.2(DO) U54.4(DI)
N$125: JP6.2 U54.2(DO)

### Notes on the sheet
- per adafruit add big cap for onrush 1000uf 6.3v

## Sheet 9 of 11: SPK to AIN
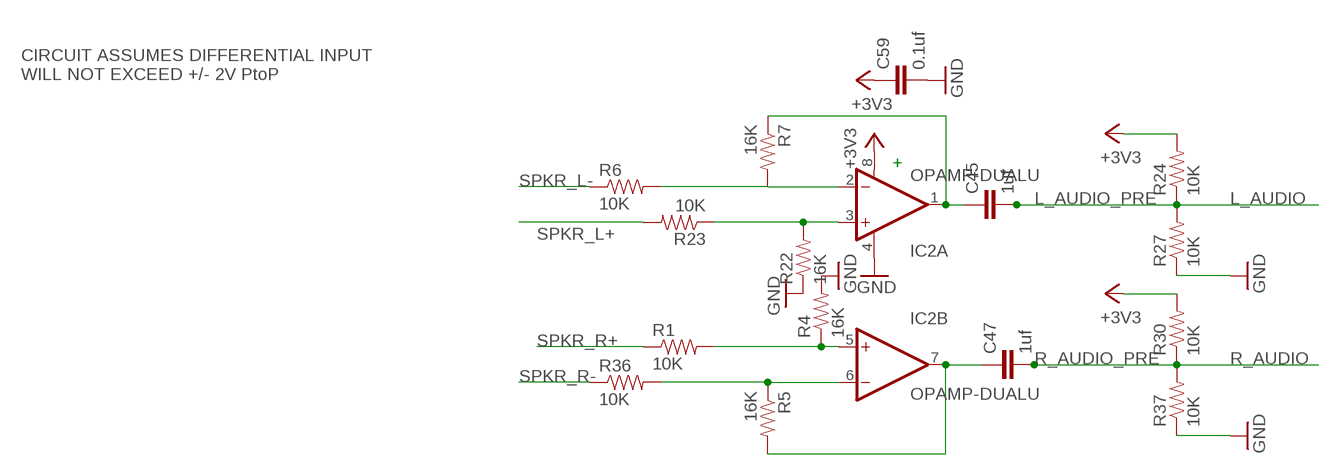
[diagram p9: schematic, sheet 9]

### Parts
C45  1uf  CAP0805  [0805]
C47  1uf  CAP0805  [0805]
C59  0.1uf  CAP0603-CAP  [0603-CAP]
IC2  OPAMP-DUALU  [SO08]
R1  10K  RESISTOR0603-RES  [0603-RES]
R4  16K  RESISTOR0603-RES  [0603-RES]
R5  16K  RESISTOR0603-RES  [0603-RES]
R6  10K  RESISTOR0603-RES  [0603-RES]
R7  16K  RESISTOR0603-RES  [0603-RES]
R22  16K  RESISTOR0603-RES  [0603-RES]
R23  10K  RESISTOR0603-RES  [0603-RES]
R24  10K  RESISTOR0603-RES  [0603-RES]
R27  10K  RESISTOR0603-RES  [0603-RES]
R30  10K  RESISTOR0603-RES  [0603-RES]
R36  10K  RESISTOR0603-RES  [0603-RES]
R37  10K  RESISTOR0603-RES  [0603-RES]

### Nets
+3V3 [+3V3]: C59.1 IC2.8(A:V+) R24.2 R30.2 ; also sheet 1,2,3,4,5
GND [gnd]: C59.2 IC2.4(A:V-) R4.2 R22.1 R27.1 R37.1 ; also sheet 1,2,3,4,5,6,7,8,10
L_AUDIO: C45.2 R24.1 R27.2 ; also sheet 1
L_AUDIO_PRE: C45.1 IC2.1(A:OUT) R7.1
N$7: IC2.5(B:+IN) R1.2 R4.1
N$8: IC2.6(B:-IN) R5.1 R36.2
N$32: IC2.3(A:+IN) R22.2 R23.1
N$113: IC2.2(A:-IN) R6.2 R7.2
R_AUDIO: C47.2 R30.1 R37.2 ; also sheet 1
R_AUDIO_PRE: C47.1 IC2.7(B:OUT) R5.2
SPKR_L+: R23.2 ; also sheet 5,6
SPKR_L-: R6.1 ; also sheet 5,6
SPKR_R+: R1.1 ; also sheet 5,6
SPKR_R-: R36.1 ; also sheet 5,6

### Notes on the sheet
- CIRCUIT ASSUMES DIFFERENTIAL INPUT
  WILL NOT EXCEED +/- 2V PtoP
- +

## Sheet 10 of 11: TACT
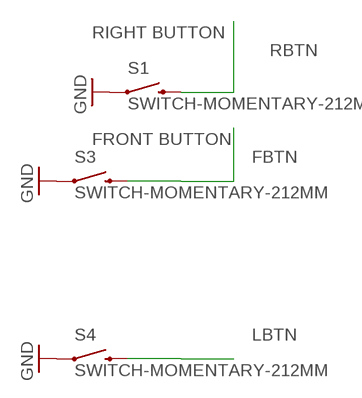
[diagram p10: schematic, sheet 10]

### Parts
S1  SWITCH-MOMENTARY-212MM  [TACTILE-PTH-12MM]
S3  SWITCH-MOMENTARY-212MM  [TACTILE-PTH-12MM]
S4  SWITCH-MOMENTARY-212MM  [TACTILE-PTH-12MM]

### Nets
FBTN: S3.3 ; also sheet 1
GND [gnd]: S1.1 S3.1 S4.1 ; also sheet 1,2,3,4,5,6,7,8,9
LBTN: S4.3 ; also sheet 1
RBTN: S1.3 ; also sheet 1

### Notes on the sheet
- RIGHT BUTTON
- FRONT BUTTON

## Sheet 11 of 11
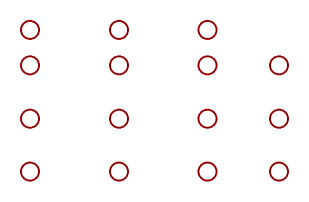
[diagram p11: schematic, sheet 11]

### Parts
STANDOFF1  STAND-OFF  [STAND-OFF]
STANDOFF2  STAND-OFF  [STAND-OFF]
STANDOFF3  STAND-OFF  [STAND-OFF]
STANDOFF4  STAND-OFF  [STAND-OFF]
STANDOFF5  STAND-OFF  [STAND-OFF]
STANDOFF6  STAND-OFF  [STAND-OFF]
STANDOFF7  STAND-OFF  [STAND-OFF]
STANDOFF8  STAND-OFF  [STAND-OFF]
STANDOFF9  STAND-OFF  [STAND-OFF]
STANDOFF10  STAND-OFF  [STAND-OFF]
STANDOFF11  STAND-OFF  [STAND-OFF]
STANDOFF12  STAND-OFF  [STAND-OFF]
STANDOFF13  STAND-OFF  [STAND-OFF]
STANDOFF14  STAND-OFF  [STAND-OFF]
STANDOFF15  STAND-OFF  [STAND-OFF]

## Library data of the parts
AOZ1015AI AOZ1015AI1 = Digistump:AOZ1021
C1-C5 C8 C9 C12 C14 C17 C22-C44 C46 C48-C58 C64-C73 C78-C80 C85-C93 C95 C98 IN-CAP IN-CAP1 OUT-CAP1 OUT-CAP2 = SparkFun:CAP: Capacitor Standard 0603 ceramic capacitor, and 0.1" leaded capacitor.
C6 C7 C10 C11 C13 C15 C16 C18-C21 C45 C47 C59 C60 = SparkFun-Passives:CAP: Capacitor Standard 0603 ceramic capacitor, and 0.1" leaded capacitor.
CN1 CN2 = adafruit:JST_2PIN: JST 2-Pin Connectors of various flavors SMT-RA (S2B-PH-SM4) 4UConnector #17311 SMT (B2B-PH-SM4) THM-RA (S2B-PH) THM (B2B-PH)
D2 = diode:BAT54C: Schottky Diodes Source: Fairchild .. BAT54.pdf
IC2 = SparkFun-AnalogIC:OPAMP-DUAL: Generic op-amp footprint
IC3 = 74xx-little-us:74*2G125: Dual line drivers with 3-state outputs.
IC4 = linear:MC33269ST*: Adjustable Output Low Dropout Voltage Regulator 800 mA Source: http://www.onsemi.com/pub/Collateral/MC33269-D.PDF
J1 = SparkFun-Connectors:POWER_JACK: Power Jack This is the standard 5.5mm barrel jack for power. The PTH is the most common, proven, reliable, footprint. The Slot footprint only works if the mill layer is transmitted to the PCB fab house so be warned. Spark Fun Electronics SKU : PRT-00119 SMT: CONN-08106 Mating wall wart : TOL-00298 (and others)
J2 = tag-connect:TC2030: TAG-CONNECT ICSP Connector Manufacturer: Tag-Connect <http://www.tag-connect.com> Cable for easy In-Circuit Serial Programming. Designed for Microchip ICD2, suitable for many others. Two variants - one "with legs" (for hands-free fit on PCB) and another "without legs" for quick programming. PAD Description 1 MCLR/Vpp 2 Vdd 3 GND 4 PGD (ISPDAT) 5 PGC (ISPCLK) 6 nc (used for LVP) ©2009 ROFA.cz - modified and updated by Robert Darlington ‹rdarlington@gmail.com›
JP1 = SparkFun-Connectors:M10: Header 10 Standard 10-pin 0.1" header. Use with straight break away headers (SKU : PRT-00116), right angle break away headers (PRT-00553), swiss pins (PRT-00743), machine pins (PRT-00117), and female headers (PRT-00115).
JP2 = SparkFun-Connectors:M09: Header 9 Standard 9-pin 0.1" header. Use with straight break away headers (SKU : PRT-00116), right angle break away headers (PRT-00553), swiss pins (PRT-00743), machine pins (PRT-00117), and female headers (PRT-00115).
JP3-JP5 = SparkFun-Connectors:M04: Header 4 Standard 4-pin 0.1" header. Use with straight break away headers (SKU : PRT-00116), right angle break away headers (PRT-00553), swiss pins (PRT-00743), machine pins (PRT-00117), and female headers (PRT-00115). Molex polarized connector foot print use with SKU : PRT-08231 with associated crimp pins and housings. 1MM SMD Version SKU: PRT-10208
JP6 JP8 = SparkFun-Connectors:M03: Header 3 Standard 3-pin 0.1" header. Use with straight break away headers (SKU : PRT-00116), right angle break away headers (PRT-00553), swiss pins (PRT-00743), machine pins (PRT-00117), and female headers (PRT-00115). Molex polarized connector foot print use with SKU : PRT-08232 with associated crimp pins and housings.
L6 = SparkFun-Passives:INDUCTOR: Inductors Basic Inductor/Choke - 0603 and 1206. Footprints are not proven and vary greatly between part numbers.
Q1 = SparkFun-DiscreteSemi:TRANSISTOR_PNP: Generic PNP BJT. Double check pinouts against datasheets- not all devices are the same!
Q2 = adafruit:XTAL-4: Classic 4-pin 3.2 x 2.5mm crystal
Q3 = SparkFun-DiscreteSemi:TRANSISTOR_NPN: Generic NPN BJT. MMBT2222 is the common NPN we use. Double check against datasheet- not all devices are the same!
R1 R3-R7 R11-R25 R27 R28 R30 R31 R36 R37 = SparkFun:RESISTOR: Resistor Basic schematic elements and footprints for 0603, 1206, and PTH resistors.
R2 R32 R33 R39-R42 = SparkFun-Passives:RESISTOR: Resistor Basic schematic elements and footprints for 0603, 1206, and PTH resistors.
R8 = SparkFun:PHOTOCELL: Photocell Also known as a CdS photoresistor. This is a low cost way to detect light levels. Resistance decreases with more incoming light. SparkFun SKU: SEN-09088
R9 R10 R26 R29 R34 R35 R38 = SparkFun-Resistors:RESISTOR: Resistor Basic schematic elements and footprints for 0603, 1206, and PTH resistors.
S1 S3 S4 = SparkFun-Electromechanical:SWITCH-MOMENTARY-2: Various NO switches- pushbuttons, reed, etc
SJ3 SJ4 = SparkFun-Passives:SOLDERJUMPER: Solder Jumper Standard SMD solder jumper. Used to automate production. Two varients : Normally Open and Normally Closed are the same, but have different paste layers. NC will have a large amount of paste and should jumper during reflow.
STANDOFF1-STANDOFF15 = SparkFun-Electromechanical:STAND-OFF: #4 Stand Off This is the mechanical footprint for a #4 phillips button head screw. Use the keepout ring to avoid running the screw head into surrounding components. SKU : PRT-00447
SW1 = dp_devices:SW_TACT_4P
U1-U55 U58 = Digistump:LED-TRICOLOR-5050-IC: 5x5mm SMD LED with built-in controller IC.
U59 = SparkFun-RF:BC127: Blue Creations BC127 BLE module Hyper-competent Bluetooth 4.0 module, with: - Pre-4.0 support - 4 Cap sense inputs - 1 Analog input - 8 GPIO - 3 Open-drain LED drivers - Onboard battery charge circuitry - SPP/UART support - PCM Audio support - SPI port - Built-in USB - All kinds of other crazy crap
U$1 U$2 = Digistump:SRP7030F
U$3 = Digistump:MAX98400B
U$4 = SparkFun-Sensors:MIC: Omni-directional electret microphone. 9.7mm standard diameter.
U$5 = TeensyCustom:MK20DX128VLH5: Teensy 3.0 Processing Unit - MK20DX128VLH5 ARM Cortex M0 Datasheet: http://cache.freescale.com/files/32bit/doc/data_sheet/K20P64M50SF0.pdf
U$6 = Custom:DUAL-PORT-USB-REC: Dual USB Receptacle, Horizontal.
U$7 = adafruit:CR1220: CR1216/CR1220/CR1225 12mm 3V lithium coin cell Great for battery packup. Both SMT and THM holders. Note the THM package has the ground pads on both sides of the PCB so that the masks are the same - this reduces the cost
U$8 = SparkFun-Sensors:IRRECEIVER: TSOP85238 38kHz IR receiver with built in demodulation and filtering- SEN-08545
X3 = embeddedmicro:USB: USB Connectors USB-B-PTH is fully proven SKU : PRT-00139/CONN-08278 USB-miniB is fully proven SKU : PRT-00587 USB-A-PCB is untested. USB-A-H is throughly reviewed, but untested. Spark Fun Electronics SKU : PRT-00437 USB-B-SMT is throughly reviewed, but untested. Needs silkscreen touching up. USB-A-S has not been used/tested USB-MB-H has not been used/tested USB-MICROB has been used. CONN-09505; PROD_ID: CONN-09505
Y2 = Arduino_Wifi_shield_v018_tG:RESONATOR_EPSON_FC_145

## Net classes
0 default: width 0.152 mm, clearance 0.152 mm
1 USB: width 0.203 mm, clearance 0.203 mm to class 0, clearance 0.305 mm
2 gnd: width 0.203 mm, clearance 0.203 mm to class 0, clearance 0.203 mm to class 1, clearance 0.203 mm
3 usbvcc: width 0.279 mm, clearance 0.254 mm to class 0, clearance 0.406 mm to class 1, clearance 0.406 mm to class 2, clearance 0.254 mm
4 +3V3: width 0.254 mm, clearance 0.203 mm to class 0, clearance 0.203 mm to class 1, clearance 0.203 mm to class 2, clearance 0.203 mm to class 3, clearance 0.203 mm
5 5VLED: width 0.508 mm, clearance 0.203 mm to class 0, clearance 0.203 mm to class 1, clearance 0.203 mm to class 2, clearance 0.203 mm to class 3, clearance 0.203 mm to class 4, clearance 0.203 mm
6 5v: width 0.254 mm, clearance 0.152 mm to class 0, clearance 0.152 mm to class 1, clearance 0.152 mm to class 2, clearance 0.152 mm to class 3, clearance 0.152 mm to class 4, clearance 0.152 mm to class 5, clearance 0.152 mm
7 VIN: width 1.27 mm
8 SPK: clearance 0.305 mm to class 0, clearance 0.305 mm to class 1, clearance 0.305 mm to class 2, clearance 0.305 mm to class 3, clearance 0.305 mm to class 4, clearance 0.305 mm to class 5, clearance 0.305 mm to class 6, clearance 0.305 mm to class 7